# EAGLE design Stromversorgung-2 (EAGLE 7.4.0)
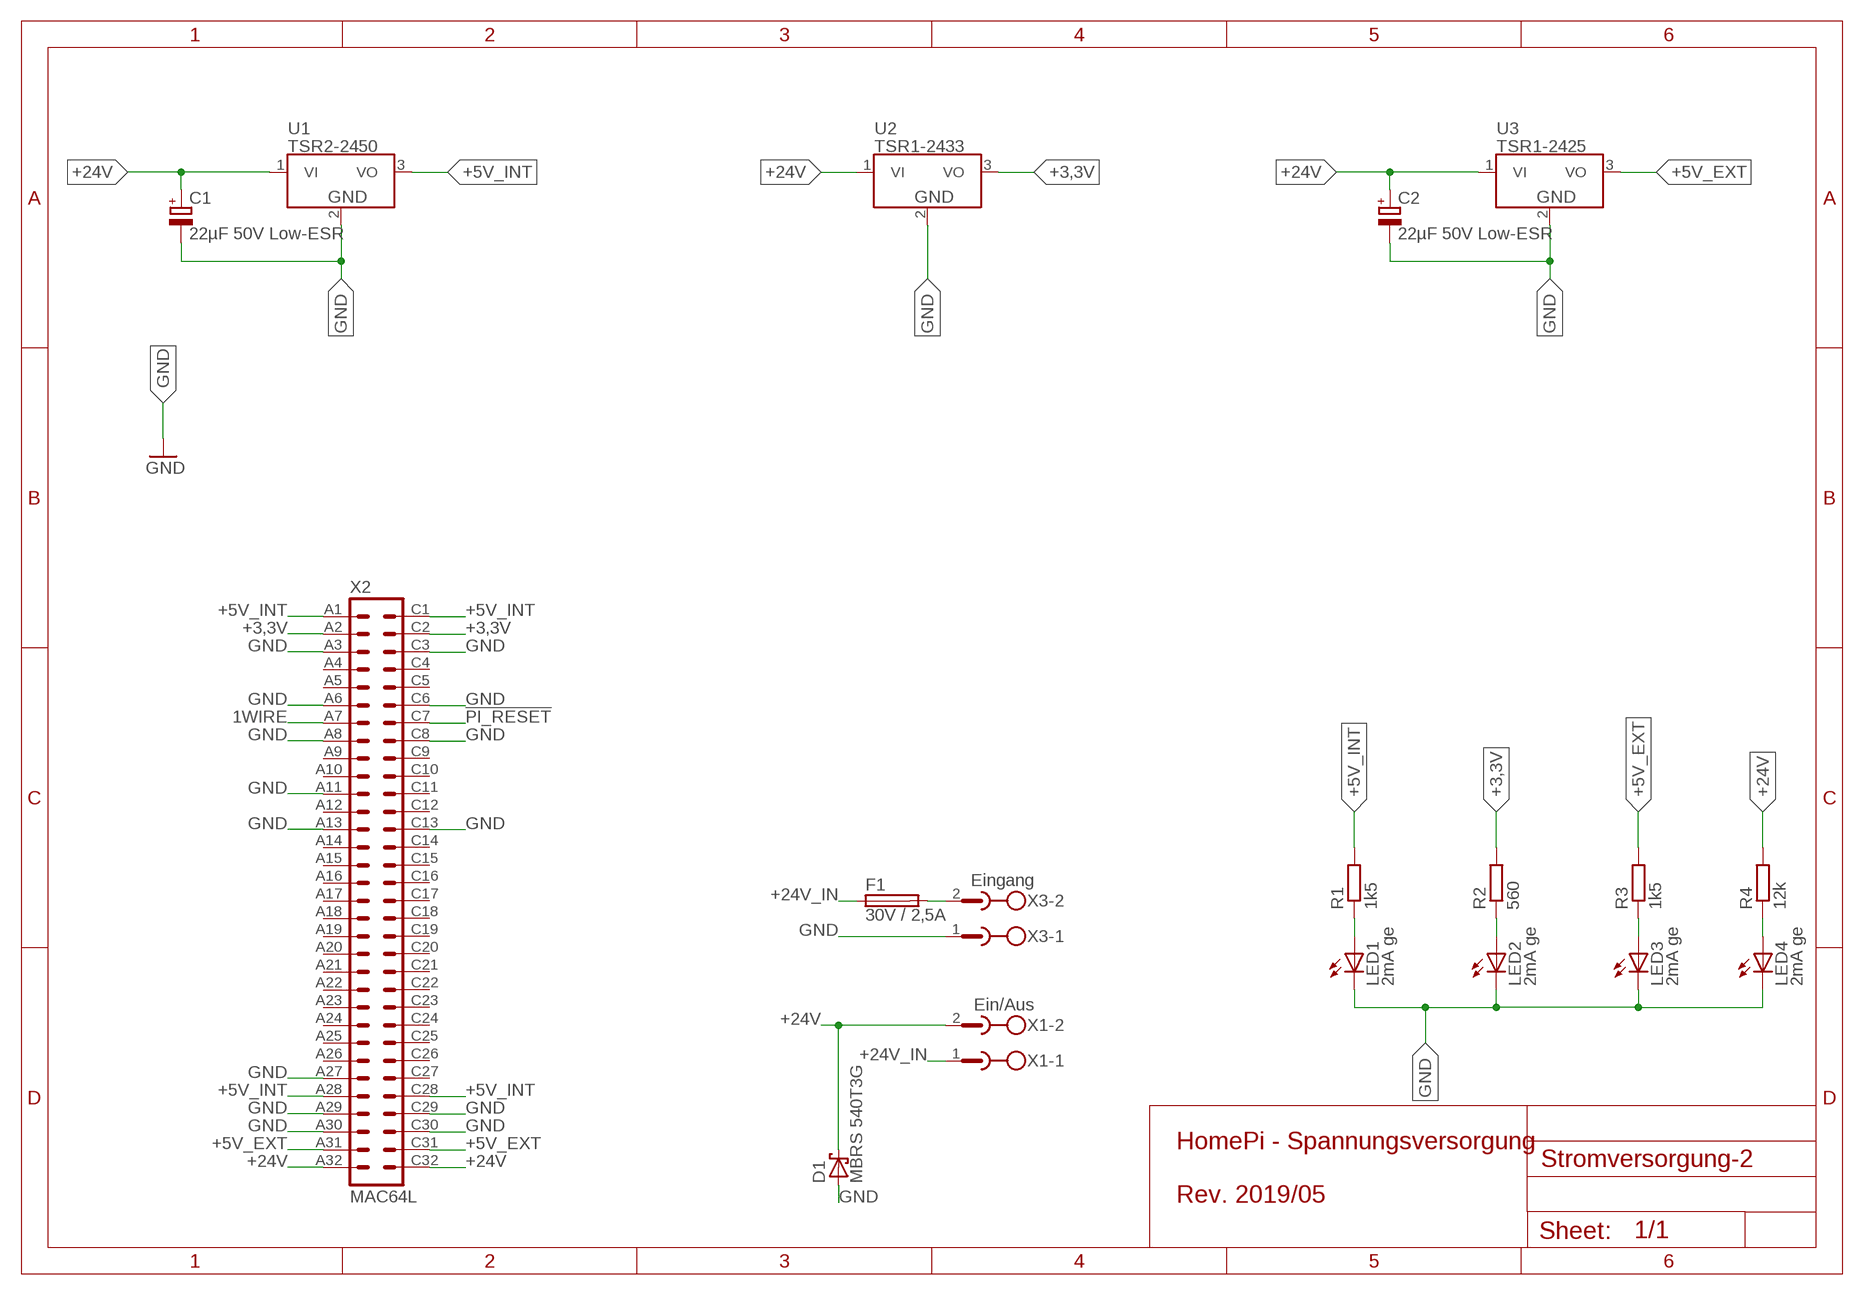
[diagram p0: schematic, sheet 1]

## Parts
C1  22µF 50V Low-ESR  CPOL-EUE2-5  [E2-5]
C2  22µF 50V Low-ESR  CPOL-EUE2-5  [E2-5]
D1  MBRS 540T3G  SCHOTTKY-DIODESMC  [SMC]
F1  30V / 2,5A  LITTLEFUSE  [LITTLEFUSE]
LED1  2mA ge  LED3MM  [LED3MM]
LED2  2mA ge  LED3MM  [LED3MM]
LED3  2mA ge  LED3MM  [LED3MM]
LED4  2mA ge  LED3MM  [LED3MM]
R1  1k5  R-EU_R1206  [R1206]
R2  560  R-EU_R1206  [R1206]
R3  1k5  R-EU_R1206  [R1206]
R4  12k  R-EU_R1206  [R1206]
U1  TSR2-2450  [TSR2]
U2  TSR1-2433  [TSR1]
U3  TSR1-2425  [TSR1]
X1  Ein/Aus  MSTBA2  [MSTBA2]
X2  MAC64L  [MAC64L]
X3  Eingang  MSTBA2  [MSTBA2]

## Nets
1WIRE: X2.A7
!PI_RESET: X2.C7
+3,3V: R2.2 U2.3(VO) X2.A2 X2.C2
+5V_EXT: R3.2 U3.3(VO) X2.A31 X2.C31
+5V_INT: R1.2 U1.3(VO) X2.A1 X2.A28 X2.C1 X2.C28
+24V [24V]: C1.+ C2.+ D1.C R4.2 U1.1(VI) U2.1(VI) U3.1(VI) X1.2 X2.A32 X2.C32
+24V_IN: F1.1 X1.1
+24V_IN_RAW: F1.2 X3.2
GND: C1.- C2.- D1.A LED1.K(C) LED2.K(C) LED3.K(C) LED4.K(C) U1.2(GND) U2.2(GND) U3.2(GND) X2.A3 X2.A6 X2.A8 X2.A11 X2.A13 X2.A27 X2.A29 X2.A30 X2.C3 X2.C6 X2.C8 X2.C13 X2.C29 X2.C30 X3.1
N$3: LED4.A R4.1
N$6: LED1.A R1.1
N$7: LED2.A R2.1
N$8: LED3.A R3.1
Unconnected: X2.A4 X2.A5 X2.A9 X2.A10 X2.A12 X2.A14 X2.A15 X2.A16 X2.A17 X2.A18 X2.A19 X2.A20 X2.A21 X2.A22 X2.A23 X2.A24 X2.A25 X2.A26 X2.C4 X2.C5 X2.C9 X2.C10 X2.C11 X2.C12 X2.C14 X2.C15 X2.C16 X2.C17 X2.C18 X2.C19 X2.C20 X2.C21 X2.C22 X2.C23 X2.C24 X2.C25 X2.C26 X2.C27

## Notes on the sheet
- HomePi - Spannungsversorgung
  
  Rev. 2019/05

## Library data of the parts
C1 C2 = rcl:CPOL-EU: POLARIZED CAPACITOR, European symbol
D1 = diode:SCHOTTKY-DIODE: Schottky Diode
F1 = fuse:LITTLEFUSE: LITTLEFUSE Picofuse/slow Littlefuse; OC_FARNELL: unknown; OC_NEWARK: unknown
LED1-LED4 = led:LED: LED OSRAM: - CHIPLED LG R971, LG N971, LY N971, LG Q971, LY Q971, LO R971, LY R971 LH N974, LH R974 LS Q976, LO Q976, LY Q976 LO Q996 - Hyper CHIPLED LW Q18S LB Q993, LB Q99A, LB R99A - SideLED LS A670, LO A670, LY A670, LG A670, LP A670 LB A673, LV A673, LT A673, LW A673 LH A674 LY A675 LS A676, LA A676, LO A676, LY A676, LW A676 LS A679, LY A679, LG A679 - Hyper Micro SIDELED® LS Y876, LA Y876, LO Y876, LY Y876 LT Y87S - SmartLED LW L88C, LW L88S LB L89C, LB L89S, LG L890 LS L89K, LO L89K, LY L89K LS L896, LA L896, LO L896, LY L896 - TOPLED LS T670, LO T670, LY T670, LG T670, LP T670 LSG T670, LSP T670, LSY T670, LOP T670, LYG T670 LG T671, LOG T671, LSG T671 LB T673, LV T673, LT T673, LW T673 LH T674 LS T676, LA T676, LO T676, LY T676, LB T676, LH T676, LSB T676, LW T676 LB T67C, LV T67C, LT T67C, LS T67K, LO T67K, LY T67K, LW E67C LS E67B, LA E67B, LO E67B, LY E67B, LB E67C, LV E67C, LT E67C LW T67C LS T679, LY T679, LG T679 LS T770, LO T770, LY T770, LG T770, LP T770 LB T773, LV T773, LT T773, LW T773 LH T774 LS E675, LA E675, LY E675, LS T675 LS T776, LA T776, LO T776, LY T776, LB T776 LHGB T686 LT T68C, LB T68C - Hyper Mini TOPLED® LB M676 - Mini TOPLED Santana® LG M470 LS M47K, LO M47K, LY M47K Source: http://www.osram.convergy.de LUXEON: - LUMILED® LXK2-PW12-R00, LXK2-PW12-S00, LXK2-PW14-U00, LXK2-PW14-V00 LXK2-PM12-R00, LXK2-PM12-S00, LXK2-PM14-U00 LXK2-PE12-Q00, LXK2-PE12-R00, LXK2-PE12-S00, LXK2-PE14-T00, LXK2-PE14-U00 LXK2-PB12-K00, LXK2-PB12-L00, LXK2-PB12-M00, LXK2-PB14-N00, LXK2-PB14-P00, LXK2-PB14-Q00 LXK2-PR12-L00, LXK2-PR12-M00, LXK2-PR14-Q00, LXK2-PR14-R00 LXK2-PD12-Q00, LXK2-PD12-R00, LXK2-PD12-S00 LXK2-PH12-R00, LXK2-PH12-S00 LXK2-PL12-P00, LXK2-PL12-Q00, LXK2-PL12-R00 Source: www.luxeon.com KINGBRIGHT: KA-3528ASYC Source: www.kingbright.com
R1-R4 = rcl:R-EU_: RESISTOR, European symbol
U1 = TSR:TSR2-*: TSR 2 Series, 1 A The new TSR 2 series step-down switching regulators are drop-in replacement for inefficient LMxx linear regulators. A high efficiency up to 96 % allows full load operation up to +67°C ambient temperature without the need of any heat-sink or forced cooling.The TSR 2 switching regulators provide other significant features over linear regulators, i.e. better output accuracy (±2 %), lower standby current of 2 mA and no requirement of external capacitors. The high efficiency and low standby power consumption makes these regulators an ideal solution for many battery powered applications.
U2 U3 = TSR:TSR1-*: TSR 1 Series, 1 Amp The TSR-1 series step-down switching regulators are drop-in replacement for inefficient 78xx linear regulators. A high efficiency up to 96 % allows full load operation up to +60 °C ambient temperature without the need of any heat-sink or forced cooling. The TSR-1 switching regulators provide other significant fea-tures over linear regulators, i.e. better output accuracy (±2 %), lower standby current of 2 mA and no requirement of external capacitors. The high efficiency and low standby power consumption makes these regulators an ideal solution for many battery powered applications.
X1 X3 = con-phoenix-508:MSTBA2: PHOENIX; MF: FARNELL; MPN: 1757242; OC_FARNELL: 3705171; OC_NEWARK: 71C4161
X2 = con-vg:MAC64L: CONNECTOR male, 64 pins, block, type C, rows AC, grid 5.08 mm

## Net classes
1 24V: clearance 0.406 mm

## Board
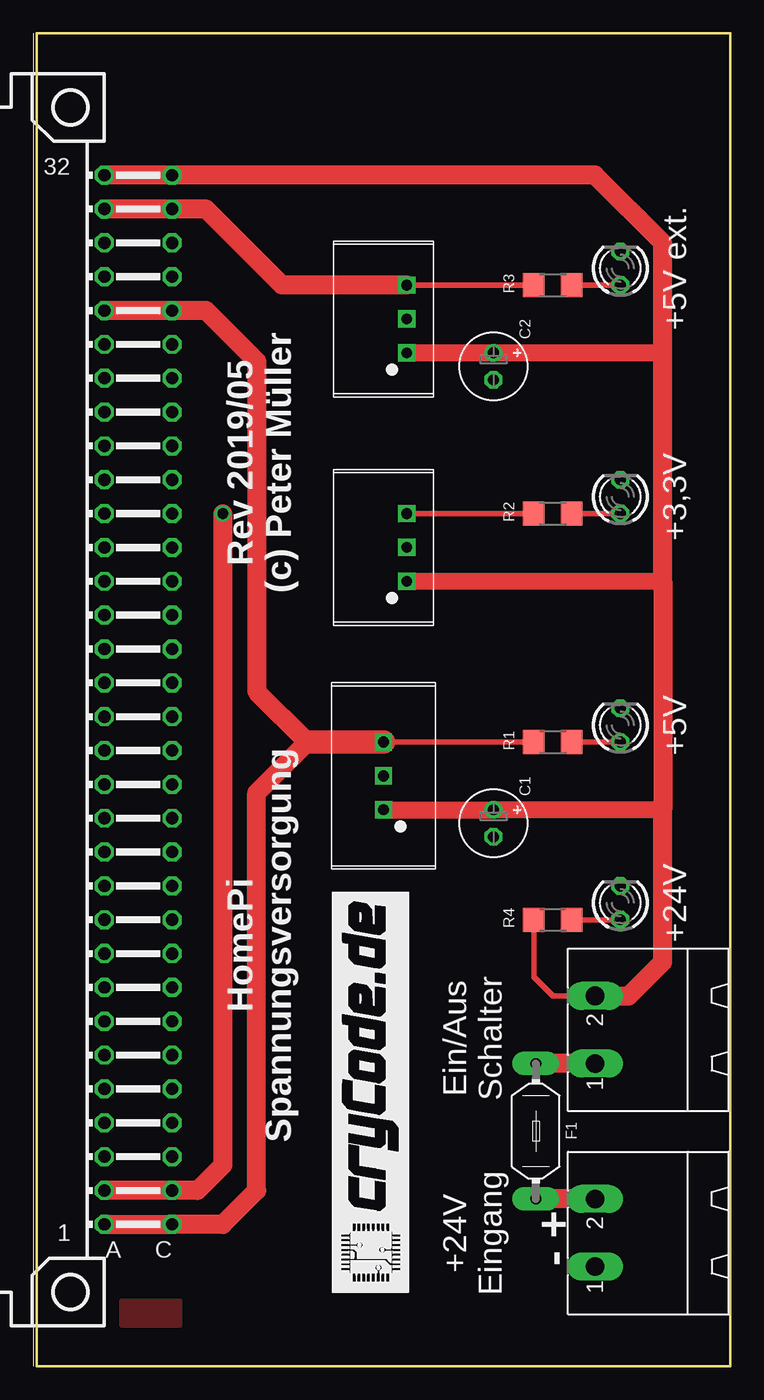
[diagram p1: board, top side]
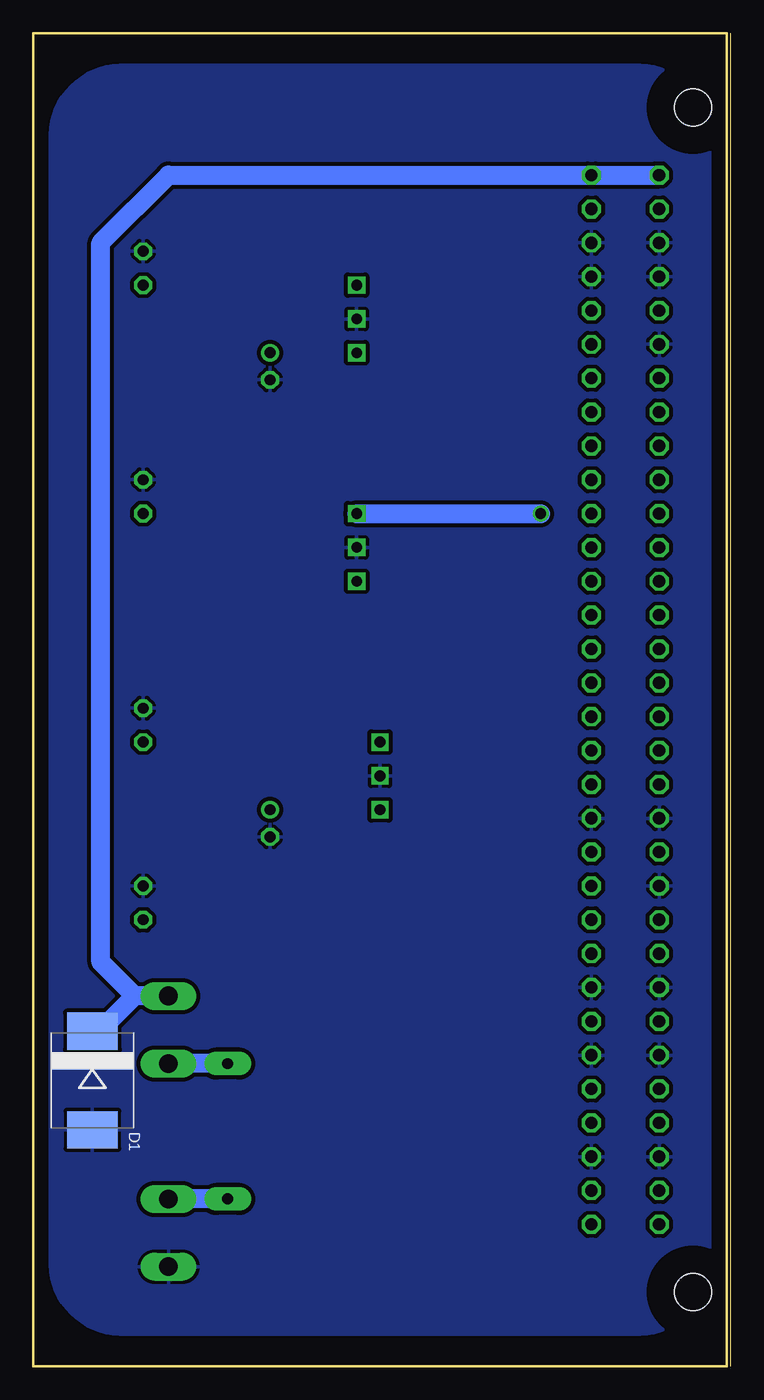
[diagram p2: board, bottom side, seen from below]

Size 52.06 x 100 mm. Coordinates in mm from the lower left corner, seen from the top.
Outline: 0,0 52.06,0 52.06,100 0,100 0,0
Copper layers (1*16): Top 0.035mm / dielectric 1.5mm / Bottom 0.035mm
Design rules "allpcb2": minimum track width 8mil, minimum drill 0.5mm, track to track 8mil, track to pad 8mil, pad to pad 8mil, via to via 8mil, smd to smd 6mil, copper to edge 40mil, drill to drill 8mil, minimum pad ring 10mil, minimum via ring 8mil, stop-mask expansion 0.1mm, vias tented up to drill 0mil, thermal gap 10mil

### Footprints (pad centres in the part's own frame; a part is rotated, then mirrored left to right if it is on the bottom)
E2-5 = drill 0.813 pad 1.27: + -1.016,0 | drill 0.813 pad 1.27 octagon: - 1.016,0
SMC = smd 2.8 x 3.8: A 3.7,0; C -3.7,0
LITTLEFUSE = drill 0.813 pad 1.778 long: 1 -5.08,0; 2 5.08,0
LED3MM = drill 0.813 octagon: A -1.27,0; K 1.27,0
R1206 = smd 1.6 x 1.803: 1 -1.422,0; 2 1.422,0
TSR2 = drill 0.8 square: 1 -2.54,0; 2 0,0; 3 2.54,0
TSR1 = drill 0.8 square: 1 -2.54,-1.75; 2 0,-1.75; 3 2.54,-1.75
MSTBA2 = drill 1.397 long: 1 -2.54,5.08; 2 2.54,5.08
MAC64L = drill 0.914 octagon: A1 -2.54,39.37; A2 -2.54,36.83; A3 -2.54,34.29; A4 -2.54,31.75; A5 -2.54,29.21; A6 -2.54,26.67; A7 -2.54,24.13; A8 -2.54,21.59; A9 -2.54,19.05; A10 -2.54,16.51; A11 -2.54,13.97; A12 -2.54,11.43; A13 -2.54,8.89; A14 -2.54,6.35; A15 -2.54,3.81; A16 -2.54,1.27; A17 -2.54,-1.27; A18 -2.54,-3.81; A19 -2.54,-6.35; A20 -2.54,-8.89; A21 -2.54,-11.43; A22 -2.54,-13.97; A23 -2.54,-16.51; A24 -2.54,-19.05; A25 -2.54,-21.59; A26 -2.54,-24.13; A27 -2.54,-26.67; A28 -2.54,-29.21; A29 -2.54,-31.75; A30 -2.54,-34.29; A31 -2.54,-36.83; A32 -2.54,-39.37; C1 -7.62,39.37; C2 -7.62,36.83; C3 -7.62,34.29; C4 -7.62,31.75; C5 -7.62,29.21; C6 -7.62,26.67; C7 -7.62,24.13; C8 -7.62,21.59; C9 -7.62,19.05; C10 -7.62,16.51; C11 -7.62,13.97; C12 -7.62,11.43; C13 -7.62,8.89; C14 -7.62,6.35; C15 -7.62,3.81; C16 -7.62,1.27; C17 -7.62,-1.27; C18 -7.62,-3.81; C19 -7.62,-6.35; C20 -7.62,-8.89; C21 -7.62,-11.43; C22 -7.62,-13.97; C23 -7.62,-16.51; C24 -7.62,-19.05; C25 -7.62,-21.59; C26 -7.62,-24.13; C27 -7.62,-26.67; C28 -7.62,-29.21; C29 -7.62,-31.75; C30 -7.62,-34.29; C31 -7.62,-36.83; C32 -7.62,-39.37 | hole 2.794: 0,44.45; 0,-44.45

### Placement (x,y rotation side)
C1  34.29,40.73 270 top
C2  34.29,75.02 270 top
D1  47.62,21.42 270 bottom
F1  37.47,17.61 270 top
LED1  43.81,48.09 90 top
LED2  43.81,65.24 90 top
LED3  43.81,82.39 90 top
LED4  43.81,34.76 90 top
R1  38.73,46.82 180 top
R2  38.73,63.97 180 top
R3  38.73,81.11 180 top
R4  38.73,33.49 180 top
U1  26.04,44.28 90 top
U2  26.04,61.43 90 top
U3  26.04,78.58 90 top
U$1  [30MM]  27.94,5.55 90 top
X1  46.99,25.23 90 top
X2  2.54,50 180 top
X3  46.99,10 90 top

### Tracks (layer width: path | path; a pad name or v marks a point on that pad's centre or on a via)
+3,3V  (via drill 0.8)
  Top 0.406: R2.2 U2.3
  Top 1.422: X2.A2 X2.C2 12.06,13.17 13.97,15.08 v13.97,63.97
  Bottom 1.422: U2.3 v13.97,63.97
+5V_EXT
  Top 0.406: U3.3 R3.2
  Top 1.422: X2.A31 X2.C31 12.7,86.83 18.41,81.11 U3.3
+5V_INT
  Top 0.406: R1.2 U1.3
  Top 1.422: X2.A1 X2.C1 13.97,10.63 16.51,13.17 16.51,43.02 20.32,46.82 16.51,50.63 16.51,75.4 12.7,79.21 X2.C28 X2.A28
  Top 1.778: 20.32,46.82 U1.3
+24V
  Top 0.406: R4.2 37.31,29.2 38.73,27.77 X1.2
  Top 1.27: U2.1 46.99,58.89 | 46.99,41.74 C1.+ U1.1 | U3.1 C2.+ 46.99,76.04 46.99,76.03
  Top 1.422: X2.A32 X2.C32 41.91,89.37 46.99,84.29 46.99,76.03 46.99,58.89 46.99,41.74 46.99,30.31 44.45,27.77 X1.2
  Bottom 1.422: X1.2 44.45,27.77 | 44.45,27.77 46.99,30.31 46.99,84.29 41.91,89.37 X2.A32 | D1.C 47.1,25.12 44.45,27.77
+24V_IN
  Top 1.422: X1.1 F1.1
  Bottom 1.422: F1.1 X1.1
+24V_IN_RAW
  Top 1.422: X3.2 F1.2
  Bottom 1.422: F1.2 X3.2
GND
  pour Bottom (isolate 0.305): 1.27,91.91 arc-97 6.99,97.62 45.09,97.62 arc-97 50.8,91.91 50.8,8.09 arc-97 45.09,2.38 6.99,2.38 arc-97 1.27,8.09
  pour Bottom: 6.35,4.92 10.79,4.92 10.79,3.01 6.35,3.01
N$3
  Top 0.406: R4.1 LED4.A
N$6
  Top 0.406: R1.1 LED1.A
N$7
  Top 0.406: R2.1 LED2.A
N$8
  Top 0.406: R3.1 LED3.A
TOP
  pour Top: 6.35,4.92 10.79,4.92 10.79,3.01 6.35,3.01

### Text on the board
tNames: +5V ext. | Rev 2019/05 / (c) Peter Müller | +3,3V | +5V | +24V | HomePi / Spannungsversorgung | Ein/Aus / Schalter | +24V / Eingang | + | -
tRestrict: TOP
bRestrict: BOT